# EAGLE design 201_3axis (EAGLE 7.6.0)
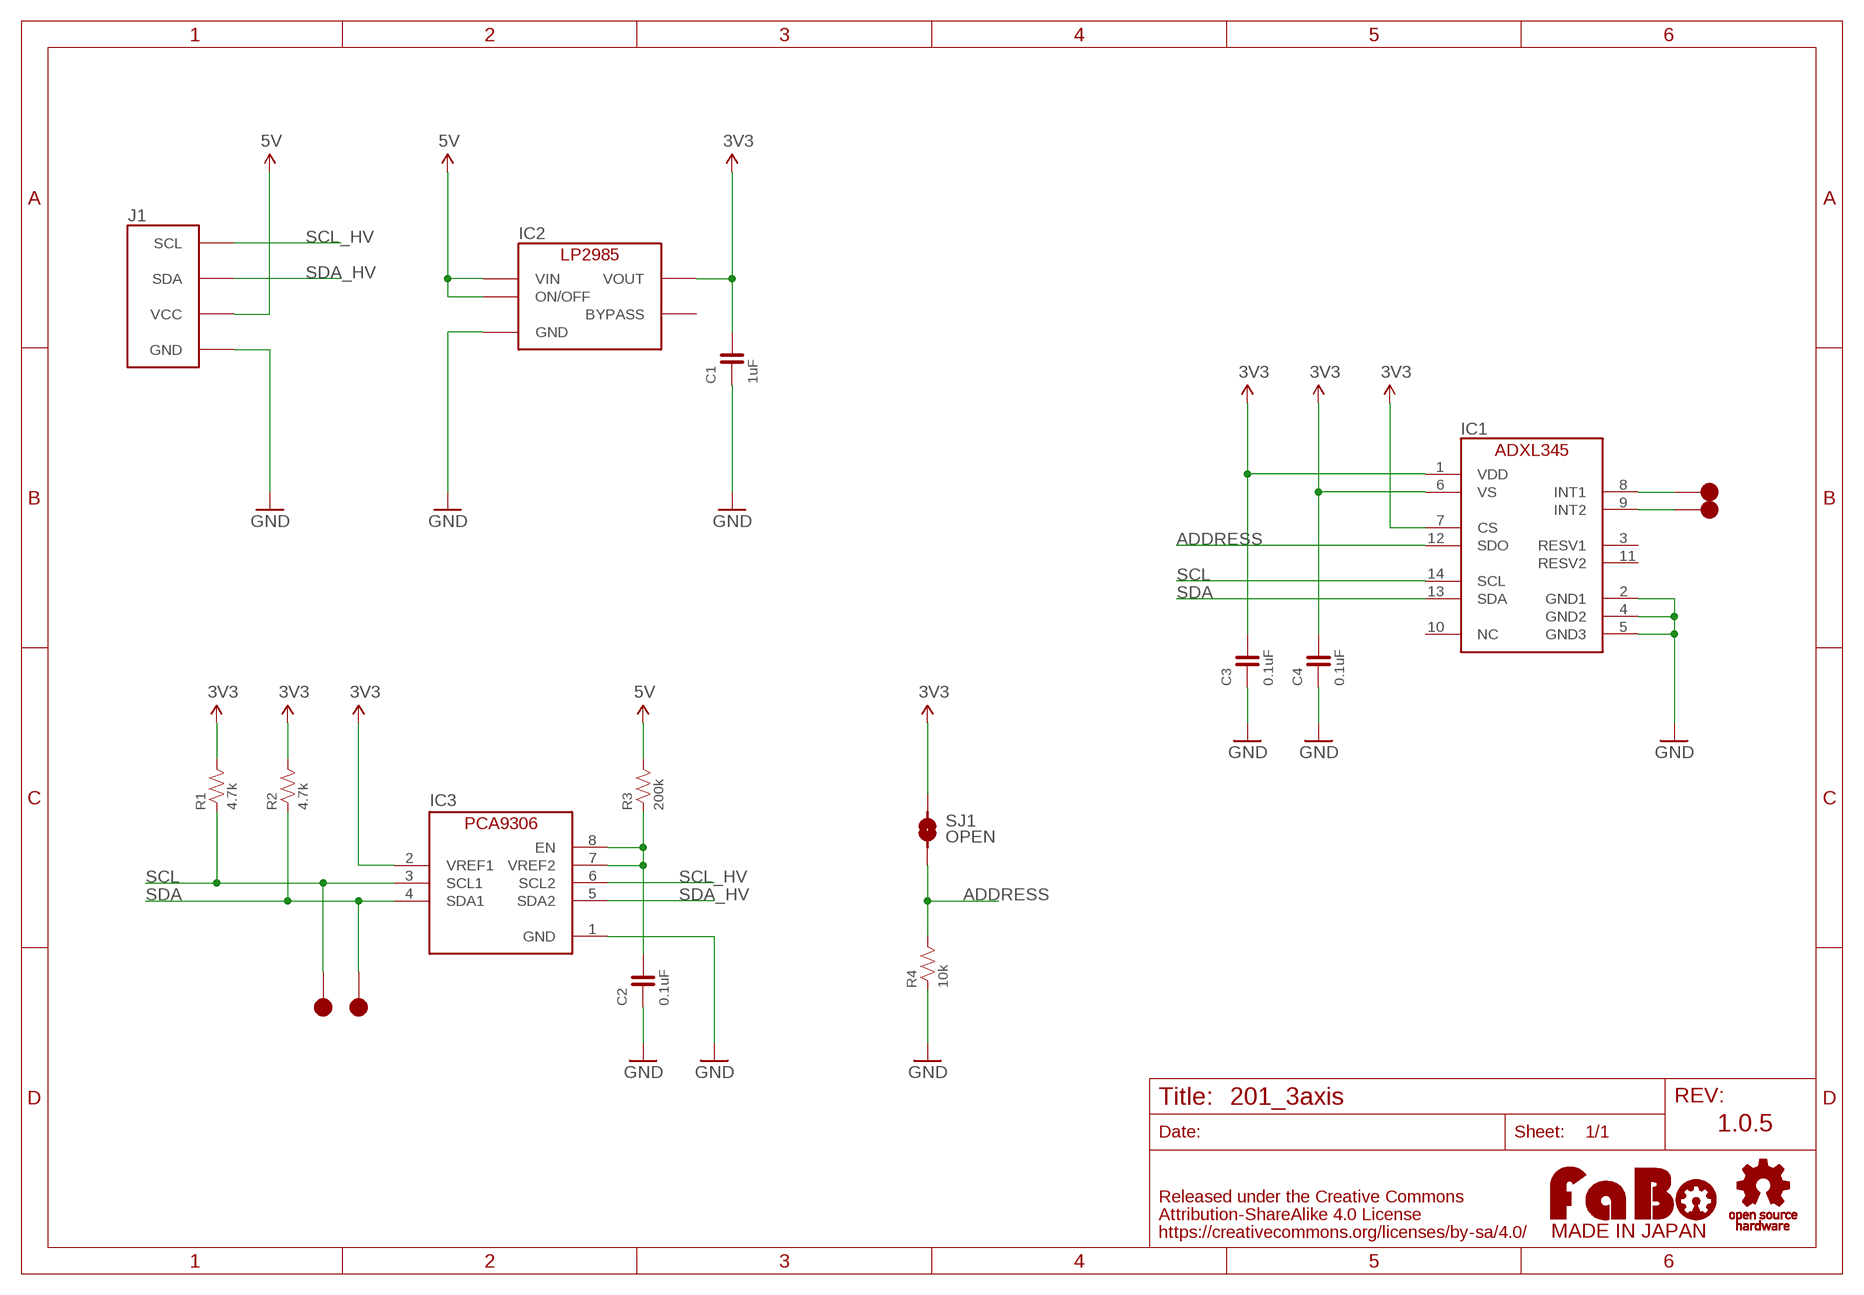
[diagram p0: schematic, sheet 1]

## Parts
C1  1uF  CAPACITOR-0603  [0603]
C2  0.1uF  CAPACITOR-0603  [0603]
C3  0.1uF  CAPACITOR-0603  [0603]
C4  0.1uF  CAPACITOR-0603  [0603]
IC1  AD-ADXL345  [ANALOGDEVICES-ADXL345]
IC2  LP2985-33DBV  [SOT-23-5]
IC3  PCA9306GM  [XQFN8]
J1  FABO_BRICK_I2C  [FABO_BRICK_I2C]
R1  4.7k  RESISTOR-0603  [0603]
R2  4.7k  RESISTOR-0603  [0603]
R3  200k  RESISTOR-0603  [0603]
R4  10k  RESISTOR-0603  [0603]
SJ1  OPEN  SMD-JUMPER-2  [SMD-JUMPER-2]
TP1  TP-15  [TP-15]
TP2  TP-15  [TP-15]
TP3  TP-15  [TP-15]
TP4  TP-15  [TP-15]
U$2  LOGO_OSHW-M_BOTTOM  [LOGO_OSHW_M_BOTTOM]
U$3  LOGO_FABO-M  [LOGO_FABO_MS]

## Nets
3V3: C1.2 C3.2 C4.2 IC1.1(VDD) IC1.6(VS) IC1.7(CS) IC2.5(VOUT) IC3.2(VREF1) R1.2 R2.2 SJ1.1
5V: IC2.1(VIN) IC2.3(ON/OFF) J1.VCC R3.2
ADDRESS: IC1.12(SDO) R4.2 SJ1.2
GND: C1.1 C2.1 C3.1 C4.1 IC1.2(GND1) IC1.4(GND2) IC1.5(GND3) IC2.2(GND) IC3.1(GND) J1.GND R4.1
N$1: C2.2 IC3.7(VREF2) IC3.8(EN) R3.1
N$2: IC1.8(INT1) TP3.1
N$3: IC1.9(INT2) TP4.1
SCL: IC1.14(SCL) IC3.3(SCL1) R1.1 TP2.1
SCL_HV: IC3.6(SCL2) J1.SCL
SDA: IC1.13(SDA) IC3.4(SDA1) R2.1 TP1.1
SDA_HV: IC3.5(SDA2) J1.SDA
Unconnected: IC1.3(RESV1) IC1.10(NC) IC1.11(RESV2) IC2.4(BYPASS)

## Notes on the sheet
- 1.0.5

## Library data of the parts
C1-C4 = FaBo-Capacitor:CAPACITOR: CAPACITOR
IC1 = FaBo-Mems:AD-ADXL345: ANALOGDEVICES ADXL345(3axis)
IC2 = FaBo-Supply:LP2985: LP2985
IC3 = FaBo-LevelTranslator:PCA9306
J1 = FaBo-Template:FABO_BRICK_I2C: FaBo Brick I2C
R1-R4 = FaBo-Resistors:RESISTOR: RESISTOR
SJ1 = FaBo-etc:SMD-JUMPER-2
TP1-TP4 = FaBo-Supply:TP
U$2 = FaBo-etc:LOGO_OSHW
U$3 = FaBo-etc:LOGO_FABO

## Board
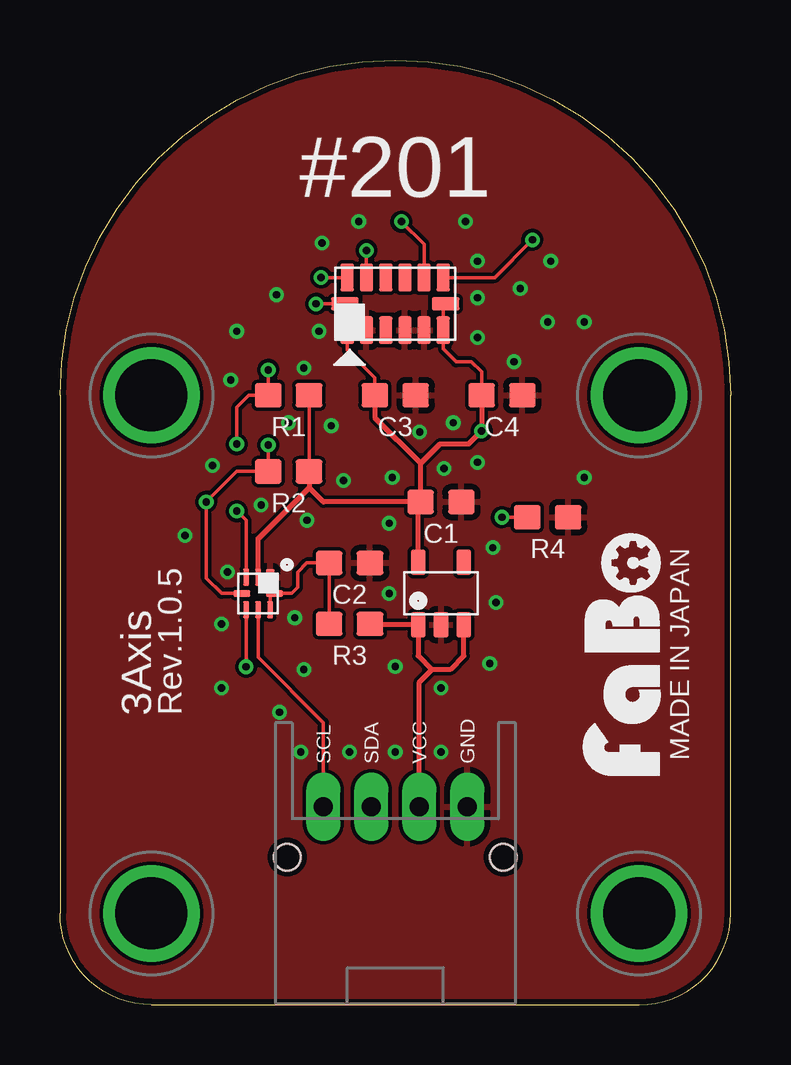
[diagram p1: board, top side]
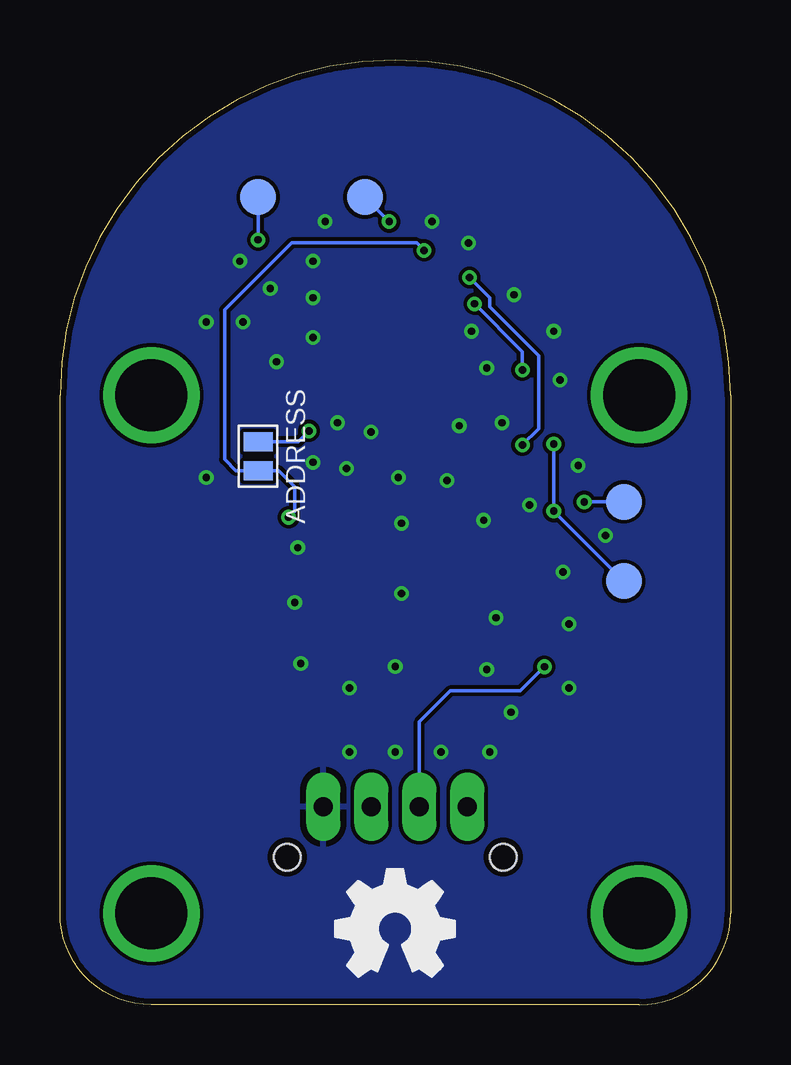
[diagram p2: board, bottom side, seen from below]

Size 27.94 x 39.37 mm. Coordinates in mm from the lower left corner, seen from the top.
Copper layers (1*16): Top 0.035mm / dielectric 1.5mm / Bottom 0.035mm
Design rules "SeeedStudio_2layer_DRU_no_angle_20140221": minimum track width 6mil, minimum drill 12mil, track to track 6mil, track to pad 6mil, pad to pad 6mil, via to via 6mil, smd to smd 0mil, copper to edge 10mil, drill to drill 10mil, minimum pad ring 10mil, minimum via ring 6mil, stop-mask expansion 2mil, vias tented up to drill 100mil, thermal gap 10mil

### Footprints (pad centres in the part's own frame; a part is rotated, then mirrored left to right if it is on the bottom)
0603 = smd 1.1 x 1: 1 -0.85,0; 2 0.85,0
ANALOGDEVICES-ADXL345 = smd 1.145 x 0.55: 1 -1.097,2; 2 -1.097,1.2; 3 -1.097,0.4; 4 -1.097,-0.4; 5 -1.097,-1.2; 6 -1.097,-2; 8 1.097,-2; 9 1.097,-1.2; 10 1.097,-0.4; 11 1.097,0.4; 12 1.097,1.2; 13 1.097,2 | smd 0.55 x 1.145: 7 0,-2.098; 14 0,2.098
SOT-23-5 = smd 0.6 x 1.05: 1 -0.95,-1.3; 2 0,-1.3; 3 0.95,-1.3; 4 0.95,1.3; 5 -0.95,1.3
XQFN8 = smd 0.7 x 0.35: 1 -0.675,0.5 | smd 0.7 x 0.25: 2 -0.675,0; 3 -0.675,-0.5; 5 0.675,-0.5; 6 0.675,0; 7 0.675,0.5 | smd 0.25 x 0.7: 4 0,-0.675; 8 0,0.675
FABO_BRICK_I2C = drill 0.8 pad 1.422 long: GND 3,-10.795; SCL -3,-10.795; SDA -1,-10.795; VCC 1,-10.795 | drill 3 pad 3.81: P$1 -10.16,6.35; P$2 10.16,6.35; P$3 -10.16,-15.24; P$4 10.16,-15.24 | hole 1.1: -4.5,-12.895; 4.5,-12.895
SMD-JUMPER-2 = smd 0.8 x 1.2: 1 -0.6,0; 2 0.6,0
TP-15 = smd 1.5 x 1.5: 1 0,0

### Placement (x,y rotation side)
C1  15.88,20.95 180 top
C2  12.06,18.41 180 top
C3  13.97,25.4 180 top
C4  18.41,25.4 180 top
IC1  13.97,29.21 90 top
IC2  15.88,17.14 0 top
IC3  8.26,17.14 270 top
J1  13.97,19.05 0 top
R1  9.53,25.4 0 top
R2  9.53,22.23 0 top
R3  12.06,15.88 0 top
R4  20.32,20.32 180 top
SJ1  19.68,22.86 270 bottom
TP1  4.45,20.95 0 bottom
TP2  4.45,17.65 0 bottom
TP3  19.68,33.66 0 bottom
TP4  15.24,33.66 0 bottom
U$2  13.97,3.17 0 top
U$3  25.4,14.61 90 top

### Tracks (layer width: path | path; a pad name or v marks a point on that pad's centre or on a via)
3V3  (via drill 0.3)
  Top 0.152: IC1.1 11.97,27.27 13.12,26.12 C3.2 | C4.2 17.57,26.38 17.14,26.8 16.51,26.8 15.97,27.34 IC1.6 15.97,29.11 IC1.7 | 12.95,20.95 C1.2 14.93,20.86 | R1.2 R2.2
  Top 0.203: C4.2 v17.57,23.91 17.02,23.37 15.83,23.37 15.03,22.57 | R2.2 10.38,21.55 | 10.38,21.55 10.97,20.95 C1.2 15.03,22.57 | IC3.2 8.26,19.43 10.38,21.55 | C3.2 13.12,24.47 15.03,22.57 | IC2.5 14.93,20.86
  Bottom 0.152: v17.57,23.91 18.02,23.46 SJ1.1
5V
  Top 0.152: 12.99,15.79 R3.2 12.95,15.85
  Top 0.203: 15.49,13.97 14.93,14.54 IC2.1 12.95,15.85 | 15.49,13.97 16.26,13.97 16.82,14.54 IC2.3 | J1.VCC 14.97,13.45 15.49,13.97
ADDRESS  (via drill 0.3)
  Top 0.152: IC1.12 v12.77,31.44 | R4.2 v18.41,20.32
  Bottom 0.152: v12.77,31.44 13.08,31.75 18.29,31.75 21.08,28.96 21.08,22.73 20.61,22.26 SJ1.2 18.83,22.26 18.16,21.59 18.16,20.57 v18.41,20.32
GND  (via drill 0.3)
  other vias: 16.38,24.26 6.99,18.03 10.29,20.19 8.38,20.83 11.81,21.84 13.72,20.07 13.84,21.97 6.35,22.48 5.21,19.56 7.11,26.04 9.53,24.26 11.3,24.13 14.99,23.88 16,22.35 17.4,22.61 10.79,28.07 10.16,26.54 9.02,29.59 7.37,28.07 20.45,30.99 19.18,29.84 17.4,30.99 17.4,29.46 17.4,27.81 20.32,28.45 21.84,28.45 18.92,26.8 21.84,21.97 18.03,19.05 13.72,17.14 9.78,16.13 13.97,14.1 15.88,13.21 15.88,10.54 13.97,10.54 12.06,10.54 10.03,10.54 10.16,13.97 9.14,12.19 18.16,16.76 16.89,32.64 12.45,32.64 10.92,31.75 6.73,15.88 6.73,13.21 17.91,14.22
  pour Top: 0,0 27.94,0 27.94,39.37 0,39.37
  pour Bottom: 0,0 27.94,0 27.94,39.37 0,39.37
N$1
  Top 0.152: IC3.7 8.76,17.14 IC3.8 9.65,17.14 9.91,17.4 9.91,18.03 10.29,18.41 C2.2 R3.1
N$2  (via drill 0.3)
  Top 0.152: IC1.8 18.12,30.31 v19.68,31.88
  Bottom 0.152: TP3.1 v19.68,31.88
N$3  (via drill 0.3)
  Top 0.152: IC1.9 15.17,31.69 v14.22,32.64
  Bottom 0.152: v14.22,32.64 TP4.1
SCL  (via drill 0.3)
  Top 0.152: v8.68,26.45 R1.1 7.87,25.4 7.37,24.89 v7.37,23.37 | v10.67,29.21 IC1.14 | IC3.3 7.75,20.18 v7.37,20.57
  Bottom 0.152: v10.67,29.21 8.68,27.22 v8.68,26.45 | v7.37,23.37 v7.37,20.57 TP2.1
SCL_HV
  Top 0.152: IC3.6 8.26,14.48 10.97,11.76 J1.SCL
SDA  (via drill 0.3)
  Top 0.152: IC1.13 v10.88,30.31 | v8.68,23.33 R2.1 7.37,22.23 v6.1,20.95 6.1,17.78 6.73,17.14 IC3.4
  Bottom 0.152: v10.88,30.31 10.03,29.46 10.03,29.08 8,27.05 8,24 v8.68,23.33 | v6.1,20.95 TP1.1
SDA_HV  (via drill 0.3)
  Top 0.152: IC3.5 v7.75,14.09
  Bottom 0.152: v7.75,14.09 8.76,13.08 11.68,13.08 12.97,11.79 J1.SDA

### Text on the board
tPlace: #201 | MADE IN JAPAN | 3Axis | Rev.1.0.5
bPlace: ADDRESS